# EAGLE design PCB_2layers (EAGLE 9.0.1)
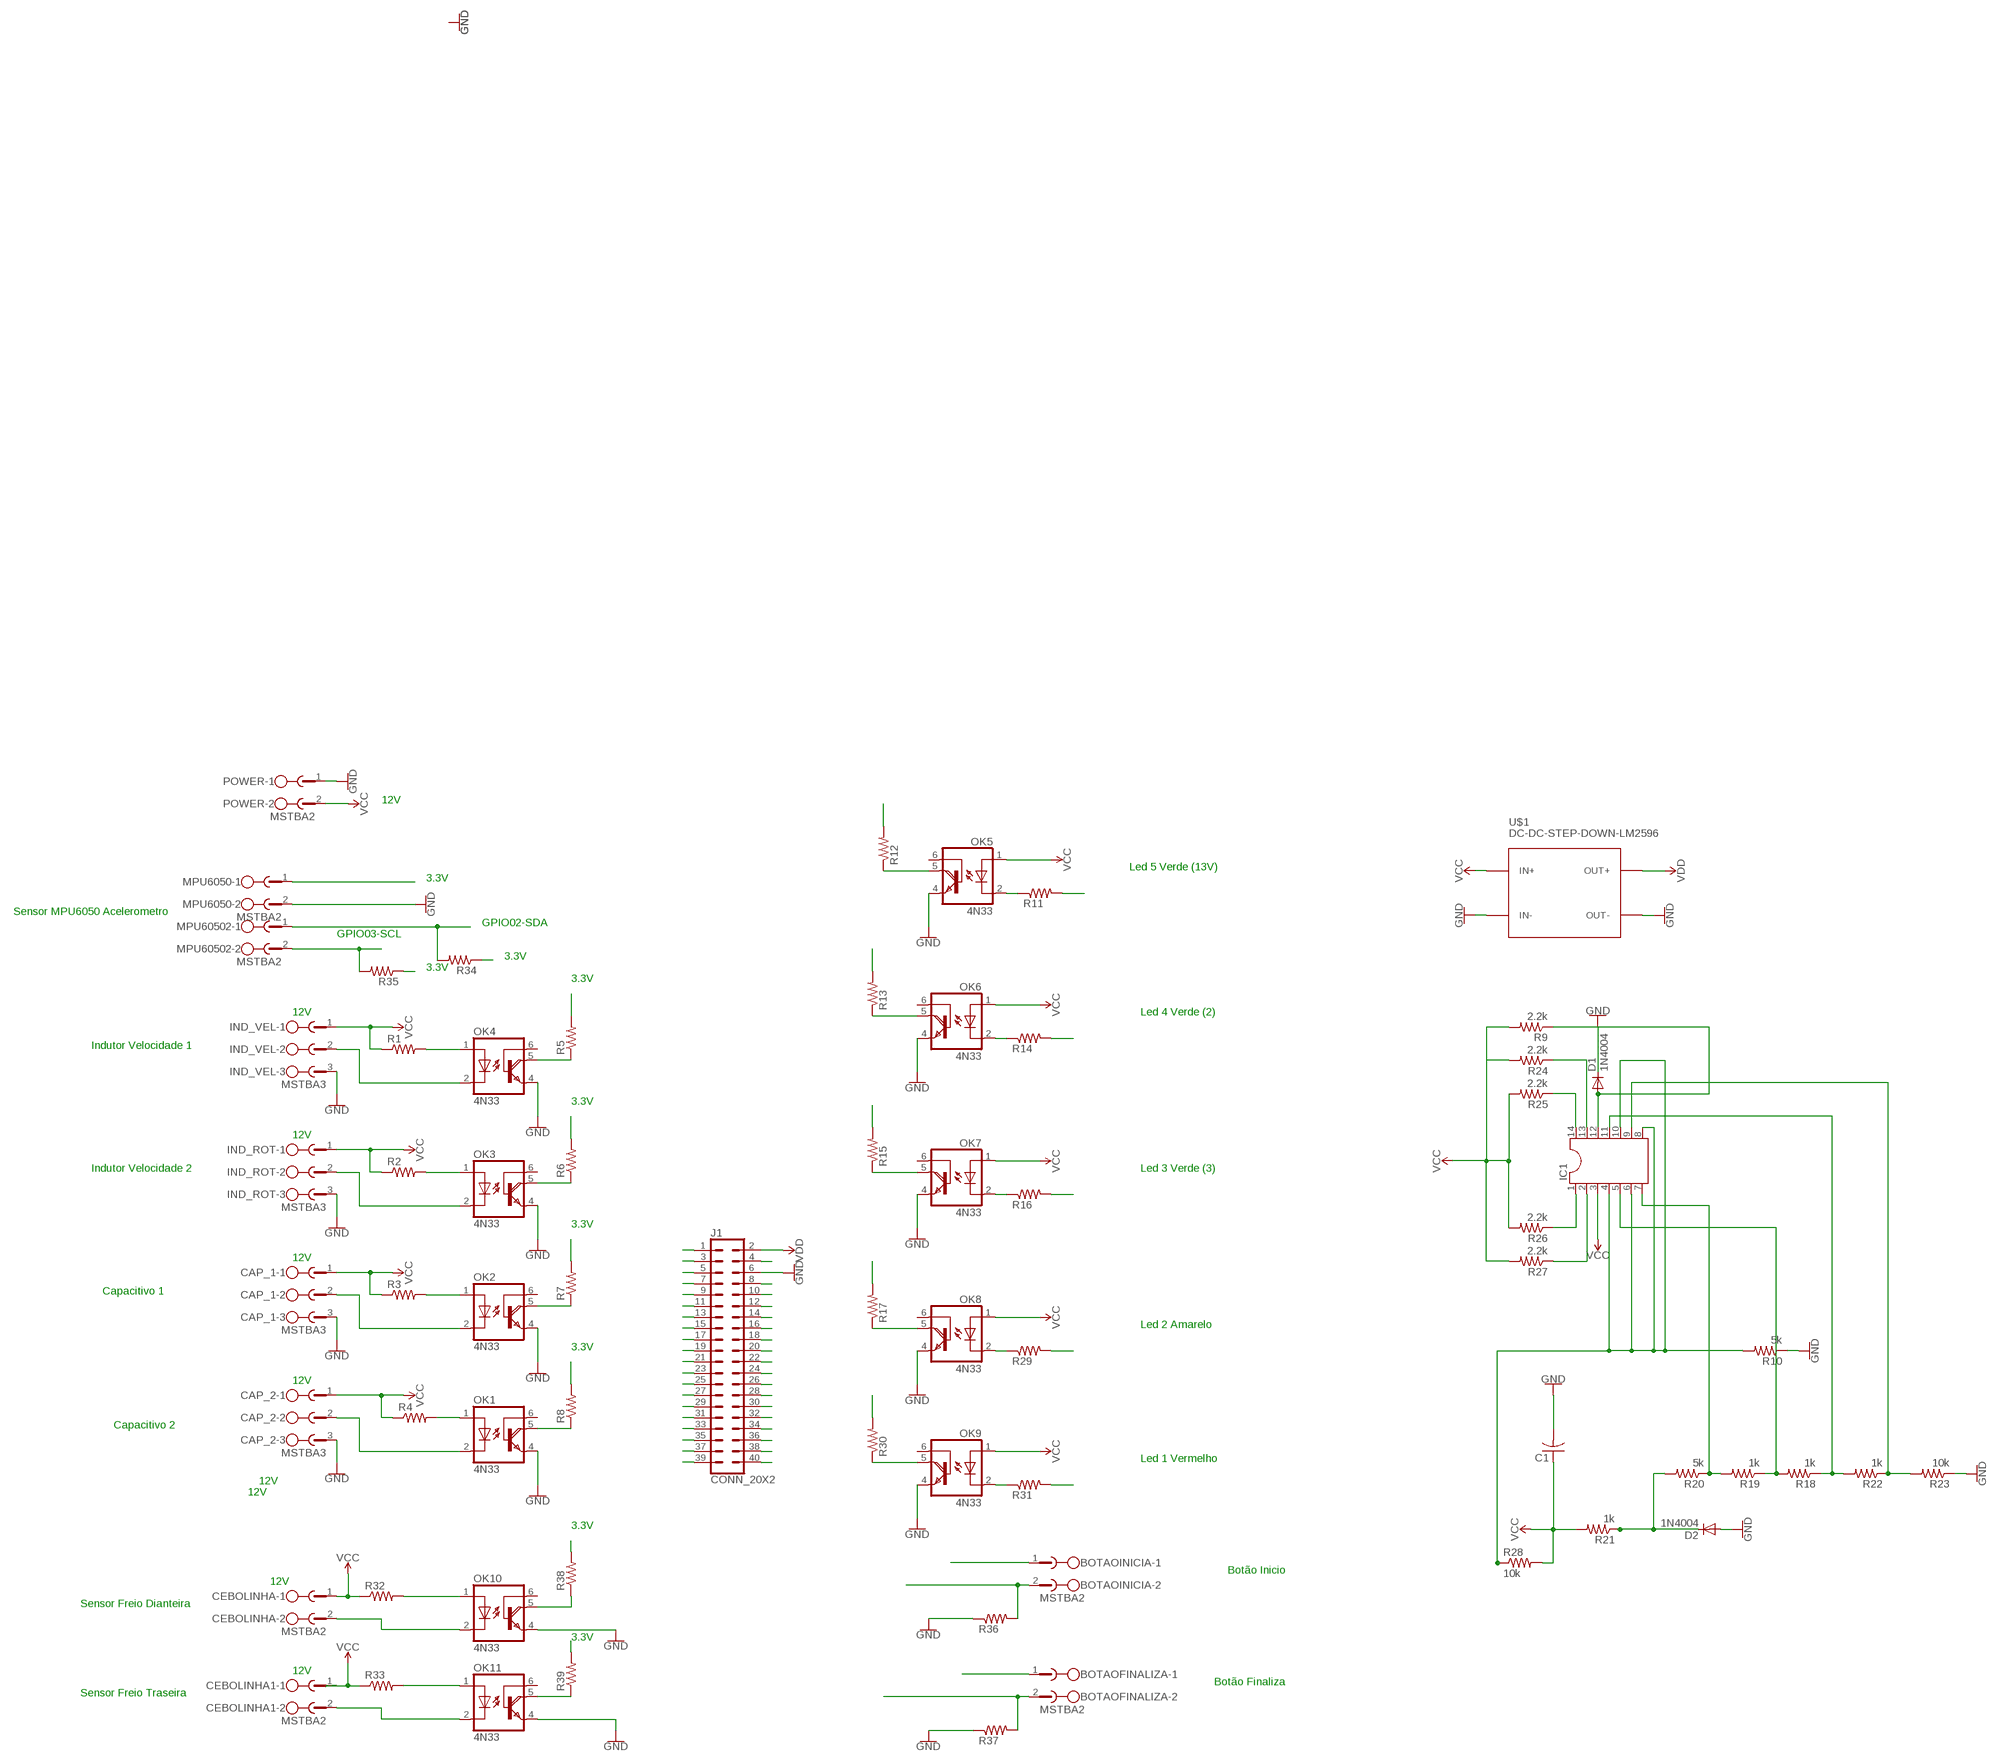
[diagram p0: schematic, sheet 1]

## Parts
BOTAOFINALIZA  MSTBA2  [MSTBA2]
BOTAOINICIA  MSTBA2  [MSTBA2]
C1  C-US025-050X050  [C025-050X050]
CAP_1  MSTBA3  [MSTBA3]
CAP_2  MSTBA3  [MSTBA3]
CEBOLINHA  MSTBA2  [MSTBA2]
CEBOLINHA1  MSTBA2  [MSTBA2]
D1  1N4004  [DO41-10]
D2  1N4004  [DO41-10]
IC1  DIL14  [DIL14]
IND_ROT  MSTBA3  [MSTBA3]
IND_VEL  MSTBA3  [MSTBA3]
J1  CONN_20X2  [2X20]
MPU6050  MSTBA2  [MSTBA2]
MPU60502  MSTBA2  [MSTBA2]
OK1  4N33  [DIL06]
OK2  4N33  [DIL06]
OK3  4N33  [DIL06]
OK4  4N33  [DIL06]
OK5  4N33  [DIL06]
OK6  4N33  [DIL06]
OK7  4N33  [DIL06]
OK8  4N33  [DIL06]
OK9  4N33  [DIL06]
OK10  4N33  [DIL06]
OK11  4N33  [DIL06]
POWER  MSTBA2  [MSTBA2]
R1  R-US_0204/7  [0204/7]
R2  R-US_0204/7  [0204/7]
R3  R-US_0204/7  [0204/7]
R4  R-US_0204/7  [0204/7]
R5  R-US_0204/7  [0204/7]
R6  R-US_0204/7  [0204/7]
R7  R-US_0204/7  [0204/7]
R8  R-US_0204/7  [0204/7]
R9  2.2k  R-US_0207/10  [0207/10]
R10  5k  R-US_0207/10  [0207/10]
R11  R-US_0204/7  [0204/7]
R12  R-US_0204/7  [0204/7]
R13  R-US_0204/7  [0204/7]
R14  R-US_0204/7  [0204/7]
R15  R-US_0204/7  [0204/7]
R16  R-US_0204/7  [0204/7]
R17  R-US_0204/7  [0204/7]
R18  1k  R-US_0207/10  [0207/10]
R19  1k  R-US_0207/10  [0207/10]
R20  5k  R-US_0207/10  [0207/10]
R21  1k  R-US_0207/10  [0207/10]
R22  1k  R-US_0207/10  [0207/10]
R23  10k  R-US_0207/10  [0207/10]
R24  2.2k  R-US_0207/10  [0207/10]
R25  2.2k  R-US_0207/10  [0207/10]
R26  2.2k  R-US_0207/10  [0207/10]
R27  2.2k  R-US_0207/10  [0207/10]
R28  10k  R-US_0207/10  [0207/10]
R29  R-US_0204/7  [0204/7]
R30  R-US_0204/7  [0204/7]
R31  R-US_0204/7  [0204/7]
R32  R-US_0204/7  [0204/7]
R33  R-US_0204/7  [0204/7]
R34  R-US_0204/7  [0204/7]
R35  R-US_0204/7  [0204/7]
R36  R-US_0204/7  [0204/7]
R37  R-US_0204/7  [0204/7]
R38  R-US_0204/7  [0204/7]
R39  R-US_0204/7  [0204/7]
U$1  DC-DC-STEP-DOWN-LM2596  [DC-DC-STEP-DOWN-LM2596]

## Nets
DC3.3V: BOTAOFINALIZA.1 BOTAOINICIA.1 J1.1 J1.17 MPU6050.1 R5.2 R6.2 R7.2 R8.2 R12.2 R13.2 R15.2 R17.2 R30.2 R34.1 R35.1 R38.2 R39.2
GND: C1.2 CAP_1.3 CAP_2.3 D1.C D2.A IND_ROT.3 IND_VEL.3 J1.6 J1.9 J1.14 J1.20 J1.25 J1.30 J1.34 OK1.4(E) OK2.4(E) OK3.4(E) OK4.4(E) OK5.4(E) OK6.4(E) OK7.4(E) OK8.4(E) OK9.4(E) OK10.4(E) OK11.4(E) POWER.1 R10.1 R23.1 R36.1 R37.1 U$1.IN- U$1.OUT-
GPIO01: CEBOLINHA1.2 OK11.2(C)
GPIO02: J1.3
GPIO2: MPU60502.2 R35.2
GPIO03: J1.5 MPU60502.1 R34.2
GPIO04: J1.7 OK4.5(COL) R5.1
GPIO05: J1.29
GPIO06: J1.31
GPIO07: J1.26
GPIO08: J1.24
GPIO09: J1.21
GPIO10: J1.19 OK1.5(COL) R8.1
GPIO11: CEBOLINHA.2 J1.23 OK10.2(C)
GPIO12: J1.32
GPIO13: J1.33
GPIO14: J1.8 OK5.5(COL) R12.1
GPIO15: J1.10 OK6.5(COL) R13.1
GPIO16: BOTAOINICIA.2 J1.36 R36.2
GPIO17: J1.11 OK3.5(COL) R6.1
GPIO18: J1.12 OK7.5(COL) R15.1
GPIO19: J1.35 OK10.5(COL) R38.1
GPIO20: BOTAOFINALIZA.2 J1.38 R37.2
GPIO21: J1.40
GPIO22: J1.15 OK2.5(COL) R7.1
GPIO23: J1.16 OK8.5(COL) R17.1
GPIO24: J1.18 OK9.5(COL) R30.1
GPIO25: J1.22
GPIO26: J1.37 OK11.5(COL) R39.1
GPIO27: J1.13
ID_SC: J1.28
ID_SD: J1.27
LM339P1: IC1.1 R11.2 R26.1
LM339P2: IC1.2 R14.2 R27.1
LM339P12: R31.2
LM339P13: IC1.13 R16.2 R24.1
LM339P14: IC1.14 R25.1 R29.2
LM33912: D1.A IC1.12 R9.1
N$1: IND_ROT.2 OK3.2(C)
N$2: CAP_2.2 OK1.2(C)
N$3: CAP_1.2 OK2.2(C)
N$4: OK3.1(A) R2.2
N$5: OK2.1(A) R3.2
N$6: OK1.1(A) R4.2
N$7: OK4.1(A) R1.2
N$8: IND_VEL.2 OK4.2(C)
N$13: D2.C R20.2 R21.1
N$14: IC1.9 R22.1 R23.2
N$15: IC1.4 IC1.6 IC1.8 IC1.10 R10.2 R28.1
N$16: IC1.5 R18.2 R19.1
N$17: IC1.11 R18.1 R22.2
N$18: IC1.7 R19.2 R20.1
N$22: J1.39
N$24: OK5.2(C) R11.1
N$27: OK6.2(C) R14.1
N$28: OK10.1(A) R32.2
N$29: OK7.2(C) R16.1
N$31: OK8.2(C) R29.1
N$33: OK9.2(C) R31.1
N$34: OK11.1(A) R33.2
VCC: C1.1 CAP_1.1 CAP_2.1 CEBOLINHA1.1 CEBOLINHA.1 IC1.3 IND_ROT.1 IND_VEL.1 OK5.1(A) OK6.1(A) OK7.1(A) OK8.1(A) OK9.1(A) POWER.2 R1.1 R2.1 R3.1 R4.1 R9.2 R21.2 R24.2 R25.2 R26.2 R27.2 R28.2 R32.1 R33.1 U$1.IN+
VDD: J1.2 J1.4 U$1.OUT+
Unconnected: MPU6050.2 OK1.6(B) OK2.6(B) OK3.6(B) OK4.6(B) OK5.6(B) OK6.6(B) OK7.6(B) OK8.6(B) OK9.6(B) OK10.6(B) OK11.6(B)

## Notes on the sheet
- 12V
- Led 5 Verde (13V)
- 3.3V
- Sensor MPU6050 Acelerometro
- GPIO02-SDA
- GPIO03-SCL
- 3.3V
- 3.3V
- 3.3V
- 12V | Led 4 Verde (2)
- Indutor Velocidade 1
- 3.3V
- 12V
- Indutor Velocidade 2 | Led 3 Verde (3)
- 3.3V
- 12V
- Capacitivo 1
- Led 2 Amarelo
- 3.3V
- 12V
- Capacitivo 2
- Led 1 Vermelho
- 12V
- 12V
- 3.3V
- Botão Inicio
- 12V
- Sensor Freio Dianteira
- 3.3V
- 12V
- Botão Finaliza
- Sensor Freio Traseira

## Library data of the parts
BOTAOFINALIZA BOTAOINICIA CEBOLINHA CEBOLINHA1 MPU6050 MPU60502 POWER = con-phoenix-508:MSTBA2: PHOENIX; MF: FARNELL; MPN: 1757242; OC_FARNELL: 3705171; OC_NEWARK: 71C4161
C1 = adafruit:C-US: CAPACITOR, American symbol
CAP_1 CAP_2 IND_ROT IND_VEL = con-phoenix-508:MSTBA3: PHOENIX; MF: FARNELL; MPN: 1757255; OC_FARNELL: 3705183; OC_NEWARK: 71C4162
D1 D2 = adafruit:1N4004: DIODE General purpose 1N400x type rectifier (With bigger pads) http://www.ladyada.net/library/pcb/eaglelibrary.html
IC1 = ic-package:DIL14: Dual In Line / Socket
J1 = SparkFun-Connectors:CONN_20X2: Multi connection point. Often used as Generic Header-pin footprint for 0.1 inch spaced/style header connections On any of the 0.1 inch spaced packages, you can populate with these: Break Away Headers - Straight <https://www.sparkfun.com/products/116> (PRT-00116) Break Away Male Headers - Right Angle <https://www.sparkfun.com/products/553> (PRT-00553) Female Headers <https://www.sparkfun.com/products/115> (PRT-00115) Break Away Headers - Machine Pin <https://www.sparkfun.com/products/117> (PRT-00117) Break Away Female Headers - Swiss Machine Pin <https://www.sparkfun.com/products/743> (PRT-00743)
OK1-OK11 = optocoupler:4N33: MOTOROLA OPTO COUPLER; MF: VISHAY/TELEFUNKEN; MPN: 4N33; OC_FARNELL: 1469601; OC_NEWARK: 88K1390
R1-R8 R11-R17 R29-R39 = rcl:R-US_: RESISTOR, American symbol
R9 R10 R18-R28 = adafruit:R-US_: RESISTOR, American symbol
U$1 = diy-modules:DC-DC-STEP-DOWN-LM2596: DC/DC Step-Down Regulator based on LM2596-ADJ chip LM2596 datasheet available here: http://www.ti.com/lit/ds/symlink/lm2596.pdf Click here to find device on ebay.com <http://www.ebay.com/sch/lm2596+power+regulator>

## Net classes
0 default: width 0.813 mm, drill 0.813 mm, clearance 0.152 mm
1 pwr: width 0.813 mm, clearance 0.254 mm

## Board
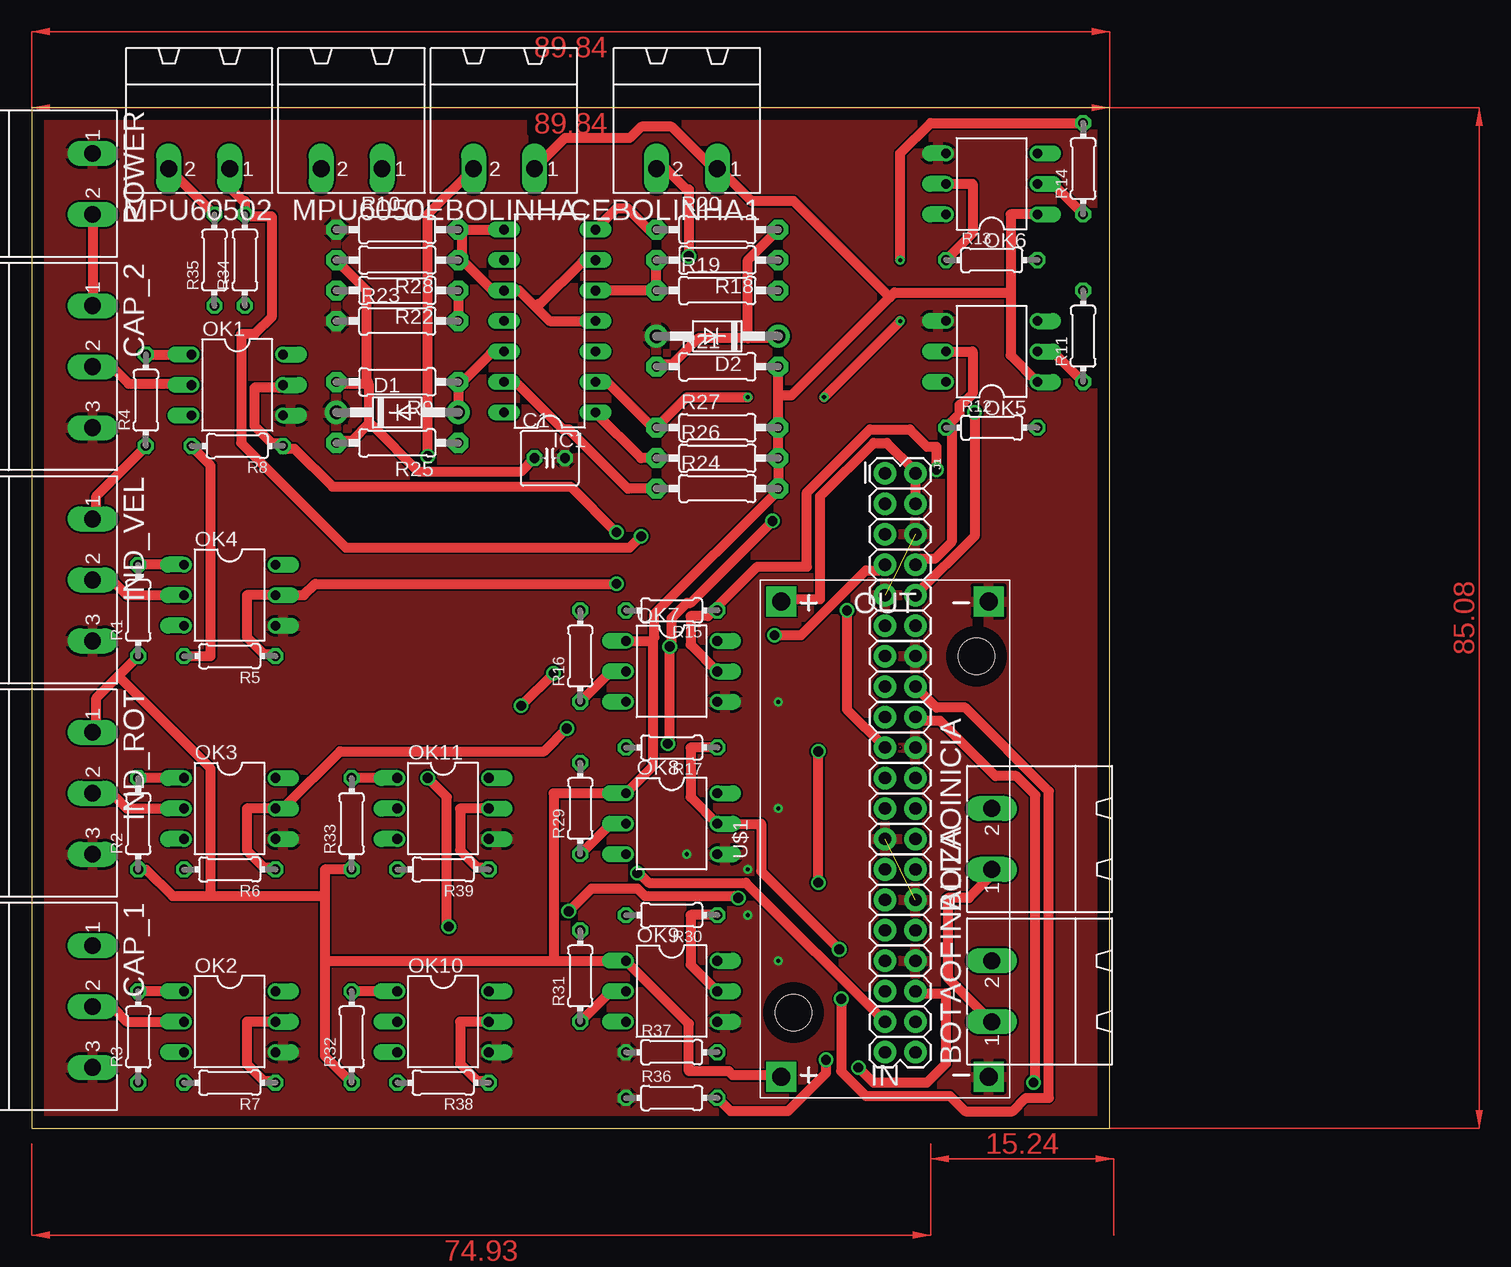
[diagram p1: board, top side]
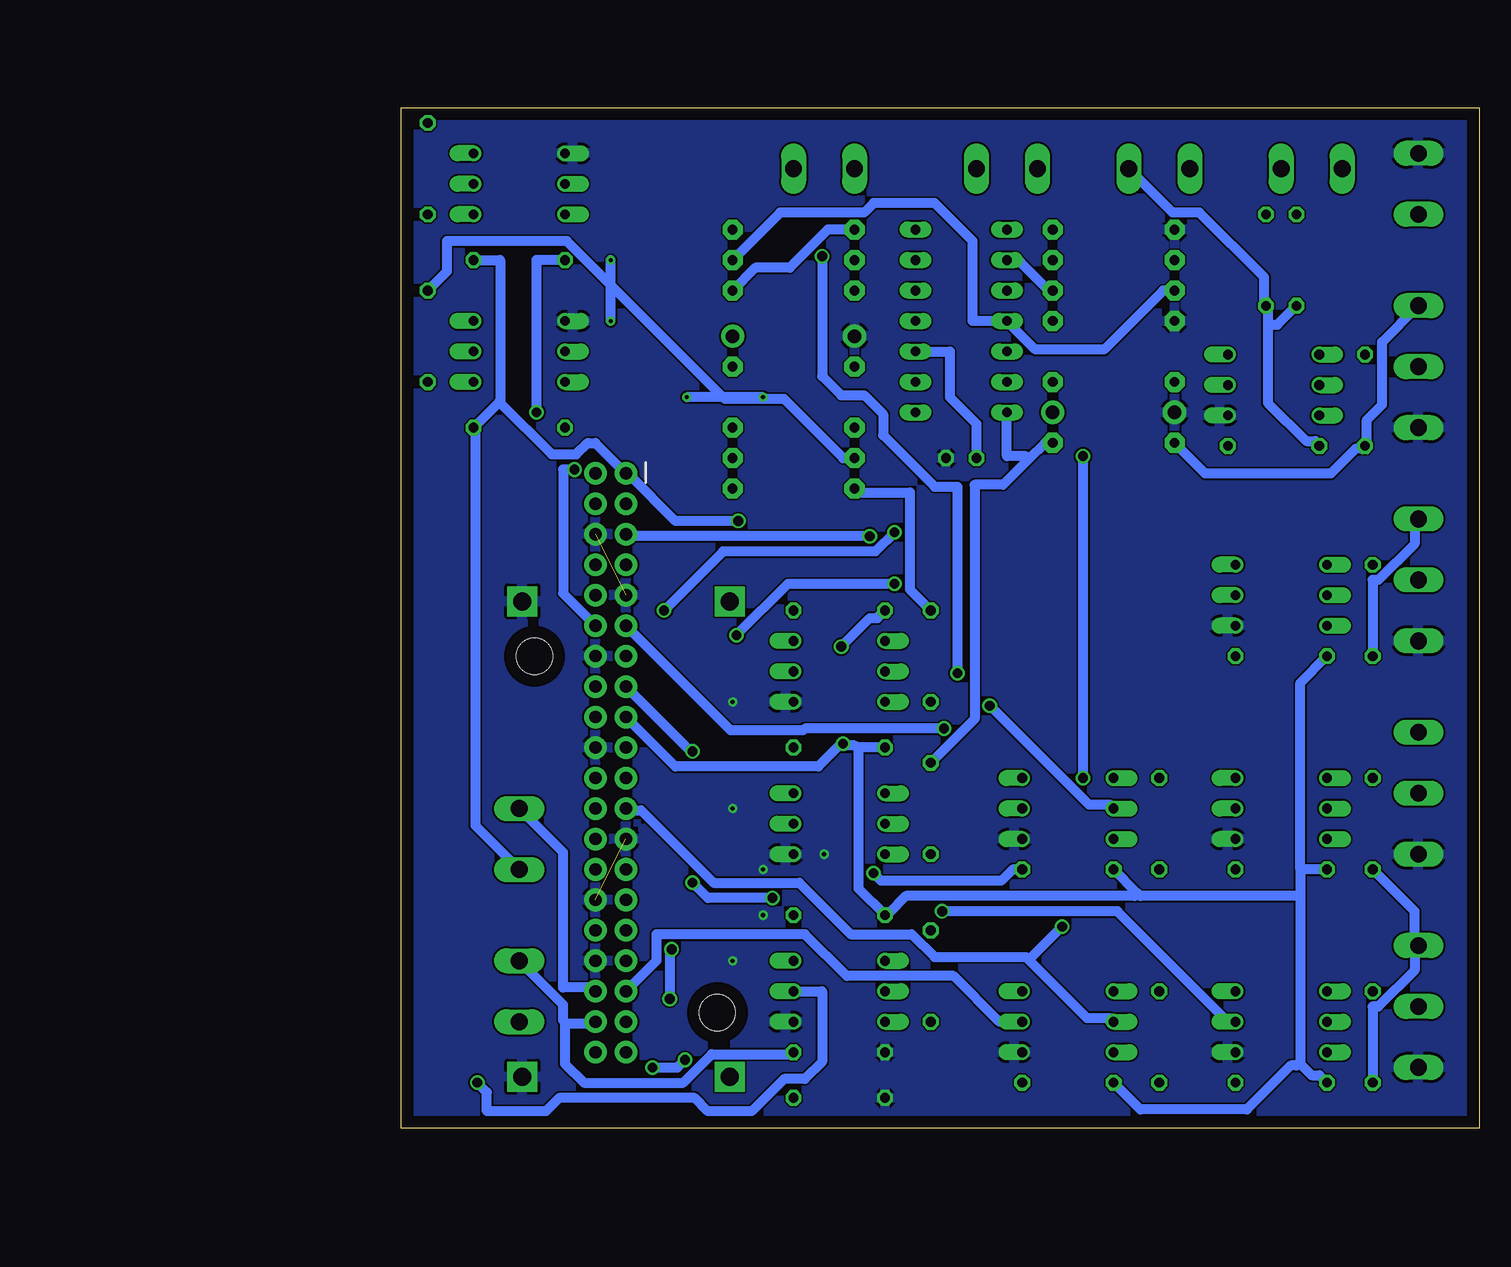
[diagram p2: board, bottom side, seen from below]

Size 89.84 x 85.08 mm. Coordinates in mm from the lower left corner, seen from the top.
Outline: 0,0 89.84,0 89.84,85.08 0,85.08 0,0
Copper layers (1*16): Top 0.035mm / dielectric 1.5mm / Bottom 0.035mm
Design rules "default": minimum track width 6mil, minimum drill 0.35mm, track to track 6mil, track to pad 6mil, pad to pad 6mil, via to via 6mil, smd to smd 6mil, copper to edge 40mil, drill to drill 6mil, minimum pad ring 10mil, minimum via ring 8mil, stop-mask expansion 4mil, vias tented up to drill 0mil, thermal gap 10mil

### Footprints (pad centres in the part's own frame; a part is rotated, then mirrored left to right if it is on the bottom)
MSTBA2 = drill 1.397 long: 1 -2.54,5.08; 2 2.54,5.08
C025-050X050 = drill 0.813 octagon: 1 -1.27,0; 2 1.27,0
MSTBA3 = drill 1.397 long: 1 -5.08,5.08; 2 0,5.08; 3 5.08,5.08
DO41-10 = drill 1.118 pad 1.93: A 5.08,0; C -5.08,0
DIL14 = drill 0.813 long: 1 -7.62,-3.81; 2 -5.08,-3.81; 3 -2.54,-3.81; 4 0,-3.81; 5 2.54,-3.81; 6 5.08,-3.81; 7 7.62,-3.81; 8 7.62,3.81; 9 5.08,3.81; 10 2.54,3.81; 11 0,3.81; 12 -2.54,3.81; 13 -5.08,3.81; 14 -7.62,3.81
2X20 = drill 1.016 pad 1.88: 1 0,0; 2 0,2.54; 3 2.54,0; 4 2.54,2.54; 5 5.08,0; 6 5.08,2.54; 7 7.62,0; 8 7.62,2.54; 9 10.16,0; 10 10.16,2.54; 11 12.7,0; 12 12.7,2.54; 13 15.24,0; 14 15.24,2.54; 15 17.78,0; 16 17.78,2.54; 17 20.32,0; 18 20.32,2.54; 19 22.86,0; 20 22.86,2.54; 21 25.4,0; 22 25.4,2.54; 23 27.94,0; 24 27.94,2.54; 25 30.48,0; 26 30.48,2.54; 27 33.02,0; 28 33.02,2.54; 29 35.56,0; 30 35.56,2.54; 31 38.1,0; 32 38.1,2.54; 33 40.64,0; 34 40.64,2.54; 35 43.18,0; 36 43.18,2.54; 37 45.72,0; 38 45.72,2.54; 39 48.26,0; 40 48.26,2.54
DIL06 = drill 0.813 offset: 1 -2.54,-3.81; 2 0,-3.81; 3 2.54,-3.81; 4 2.54,3.81; 5 0,3.81; 6 -2.54,3.81
0204/7 = drill 0.813 octagon: 1 -3.81,0; 2 3.81,0
0207/10 = drill 0.813 pad 1.676 octagon: 1 -5.08,0; 2 5.08,0
DC-DC-STEP-DOWN-LM2596 = drill 1.5 pad 2.5 square: IN+ -19.812,8.636; IN- -19.812,-8.636; OUT+ 19.812,8.636; OUT- 19.812,-8.636 | hole 3: -14.478,7.62; 15.24,-7.62

### Placement (x,y rotation side)
BOTAOFINALIZA  85.09,11.43 90 top
BOTAOINICIA  85.09,24.13 90 top
C1  43.18,55.88 0 top
CAP_1  0,10.16 270 top
CAP_2  0,63.5 270 top
CEBOLINHA  39.37,85.09 180 top
CEBOLINHA1  54.61,85.09 180 top
D1  30.48,59.69 0 top
D2  57.15,66.04 180 top
IC1  43.18,67.31 90 top
IND_ROT  0,27.94 270 top
IND_VEL  0,45.72 270 top
J1  71.12,54.61 270 top
MPU6050  26.67,85.09 180 top
MPU60502  13.97,85.09 180 top
OK1  17.15,61.98 270 top
OK2  16.51,8.89 270 top
OK3  16.51,26.67 270 top
OK4  16.51,44.45 270 top
OK5  80.01,64.77 90 top
OK6  80.01,78.74 90 top
OK7  53.34,38.1 270 top
OK8  53.34,25.4 270 top
OK9  53.34,11.43 270 top
OK10  34.29,8.89 270 top
OK11  34.29,26.67 270 top
POWER  0,78.74 270 top
R1  8.89,43.18 90 top
R2  8.89,25.4 90 top
R3  8.89,7.62 90 top
R4  9.53,60.71 90 top
R5  16.51,39.37 180 top
R6  16.51,21.59 180 top
R7  16.51,3.81 180 top
R8  17.15,56.9 180 top
R9  30.48,62.23 180 top
R10  30.48,74.93 0 top
R11  87.63,66.04 90 top
R12  80.01,58.42 0 top
R13  80.01,72.39 0 top
R14  87.63,80.01 90 top
R15  53.34,43.18 180 top
R16  45.72,39.37 90 top
R17  53.34,31.75 180 top
R18  57.15,72.39 180 top
R19  57.15,69.85 0 top
R20  57.15,74.93 0 top
R21  57.15,63.5 0 top
R22  30.48,69.85 180 top
R23  30.48,67.31 0 top
R24  57.15,53.34 0 top
R25  30.48,57.15 180 top
R26  57.15,55.88 0 top
R27  57.15,58.42 0 top
R28  30.48,72.39 180 top
R29  45.72,26.67 90 top
R30  53.34,17.78 180 top
R31  45.72,12.7 90 top
R32  26.67,7.62 90 top
R33  26.67,25.4 90 top
R34  17.78,72.39 90 top
R35  15.24,72.39 90 top
R36  53.34,2.54 0 top
R37  53.34,6.35 0 top
R38  34.29,3.81 180 top
R39  34.29,21.59 180 top
U$1  71.12,24.13 90 top

### Tracks (layer width: path | path; a pad name or v marks a point on that pad's centre or on a via)
DC3.3V  (via drill 0.81)
  Top 0.813: BOTAOFINALIZA.1 76.36,12.54 76.36,19.21 78.11,19.21 80.01,21.11 BOTAOINICIA.1 | v53.02,32.07 53.18,32.07 v53.18,40.16 53.34,40.48 53.34,42.55 54.61,43.81 54.93,43.81 v61.75,50.64 | R5.2 14.92,39.37 14.92,55.25 13.34,56.83 R8.2
  Bottom 0.813: 81.68,60.56 81.6,60.64 81.6,72.39 R13.2 | 81.68,60.56 R12.2 83.66,58.1 83.66,25.24 BOTAOINICIA.1 | 81.68,60.56 77.31,56.2 75.25,56.2 74.3,57.15 73.66,57.15 J1.1 70.8,54.45 66.99,50.64 v61.75,50.64 | 51.75,31.75 51.75,20 R30.2 49.21,17.94 47.78,19.37 28.73,19.37 28.5,19.61 | R17.2 51.75,31.75 | R15.2 50.17,42.55 50.8,42.55 v53.18,40.16 | 51.75,31.75 52.07,31.91 52.86,31.91 v53.02,32.07 53.34,31.91 55.09,30.16 66.99,30.16 J1.17 | 17.62,66.99 17.62,68.58 R34.1 17.94,68.9 17.94,70.96 23.34,76.36 25.56,76.36 MPU6050.1 | 17.62,66.99 17.62,60.48 14.45,57.31 13.65,57.31 13.34,56.99 R8.2 | R35.1 16.83,66.99 17.62,66.99 | R7.2 13.34,4.45 13.97,4.45 14.92,5.4 | 14.92,21.59 14.92,19.37 | 14.92,19.37 14.92,5.4 | R6.2 14.92,21.59 | R38.2 28.26,1.59 19.37,1.59 15.72,5.24 15.24,5.24 14.92,5.4 | R5.2 14.92,37.15 14.92,21.59 | 28.5,19.61 28.26,19.37 14.92,19.37 | 28.5,19.61 R39.2
GND  (via drill 0.35)  (2 unrouted)
  other vias: 62.23,35.56 62.23,26.67 62.23,13.97 54.61,22.86 59.69,21.59 59.69,17.78
  pour Bottom: 0,88.9 -1.27,87.63 -1.27,-1.27 0,-2.54 90.17,-2.54 91.44,-1.27 91.44,86.36 88.9,88.9
  pour Top: -1.27,87.63 -1.27,-1.27 0,-2.54 90.17,-2.54 91.44,-1.27 91.44,86.36 88.9,88.9 0,88.9
GPIO01  (via drill 0.81)
  Top 0.813: v43.5,37.94 v40.8,35.24 | v54.77,72.71 54.77,78.26 54.61,78.26 52.86,80.01 CEBOLINHA1.2
  Bottom 0.813: OK11.2 30.8,26.99 32.54,26.99 v40.8,35.24 | v43.5,37.94 43.5,53.5 45.4,53.5 49.69,57.78 49.69,59.53 51.28,61.12 53.18,61.12 54.77,62.71 v54.77,72.71
GPIO2
  Top 0.813: MPU60502.2 R35.2
GPIO03  (via drill 0.81)
  Top 0.813: MPU60502.1 16.51,78.42 17.62,77.31 17.78,77.31 R34.2 18.1,76.04 20,76.04 20,67.63 18.57,66.2 17.46,66.2 17.46,57.15 26.19,48.42 49.85,48.42 v50.8,49.37
  Bottom 0.813: J1.5 70.96,49.37 v50.8,49.37
GPIO04  (via drill 0.81)
  Top 0.813: R5.1 20.16,39.53 19.37,39.53 17.94,40.96 17.94,44.45 OK4.5 22.7,44.45 23.65,45.4 v48.74,45.4 | J1.7 70.64,46.51 69.53,46.51 64.14,41.12 v61.91,41.12
  Bottom 0.813: v61.91,41.12 57.63,45.4 v48.74,45.4
GPIO10  (via drill 0.81)
  Top 0.813: OK1.5 20.96,61.91 20.8,61.91 20.64,61.75 18.57,61.75 18.57,58.58 20,57.15 20.8,57.15 20.96,56.99 R8.1 21.27,56.67 21.91,56.67 25.08,53.5 44.93,53.5 v48.74,49.69 | J1.19 67.95,34.92 v67.95,43.18
  Bottom 0.813: v67.95,43.18 63.02,48.1 50.32,48.1 v48.74,49.69
GPIO11  (via drill 0.81)
  Top 0.813: CEBOLINHA.2 33.02,76.2 v33.02,56.04 | v33.02,29.21 34.61,27.62 34.61,16.83 v34.77,16.83
  Bottom 0.813: OK10.2 30.8,9.21 32.7,9.21 37.54,14.05 | 37.54,14.05 37.78,14.29 45.4,14.29 47.31,16.19 52.39,16.19 56.67,20.48 63.82,20.48 69.85,26.51 70.96,26.51 J1.23 | v33.02,29.21 v33.02,56.04 | 37.54,14.05 v34.77,16.83
GPIO14
  Top 0.813: OK5.5 78.42,64.77 78.42,61.28 77.47,60.33 77.31,60.33 77.31,59.53 R12.1 76.52,58.26 76.68,58.26 76.68,48.89 75.25,47.47 74.14,47.47 J1.8
GPIO15  (via drill 0.81)
  Top 0.813: R13.1 78.42,74.61 78.42,78.74 OK6.5 | J1.10 78.58,49.37 v78.58,59.69
  Bottom 0.813: v78.58,59.69 78.58,72.39 R13.1
GPIO16  (via drill 0.81)
  Top 0.813: R36.2 58.26,1.43 63.02,1.43 66.2,4.6 v66.2,5.72 | v68.9,5.08 70.17,3.81 74.61,3.81 76.2,5.4 76.2,11.27 73.82,11.27 J1.36
  Bottom 0.813: v66.2,5.72 66.83,5.08 v68.9,5.08 | BOTAOINICIA.2 76.36,23.02 76.36,11.75 74.3,11.75 73.98,11.43 J1.36
GPIO17  (via drill 0.81)
  Top 0.813: R6.1 20.16,21.75 19.37,21.75 17.94,23.18 17.94,26.67 OK3.5 20.64,26.83 21.11,26.83 25.72,31.43 42.7,31.43 v44.61,33.34
  Bottom 0.813: J1.11 62.39,33.18 56.36,33.18 56.2,33.34 v44.61,33.34
GPIO18  (via drill 0.81)
  Top 0.813: OK7.5 54.93,40.32 54.93,42.7 56.36,42.7 56.83,43.18 R15.1 57.15,43.5 60.48,46.83 64.61,46.83 64.61,53.02 69.85,58.26 73.18,58.26 74.61,56.83 75.41,56.83 v75.41,54.93
  Bottom 0.813: J1.12 76.36,44.61 76.36,54.93 v75.41,54.93
GPIO19
  Top 0.813: R38.1 37.94,3.97 37.15,3.97 35.72,5.4 35.72,8.89 OK10.5
  Bottom 0.813: J1.35 68.58,13.97 68.58,16.19 56.2,16.19 52.71,12.7 43.82,12.7 40.01,8.89 OK10.5
GPIO20
  Bottom 0.813: R37.2 57.31,6.19 63.98,6.19 66.36,3.81 74.61,3.81 76.2,5.4 76.2,8.73 | 76.2,8.73 73.82,8.73 J1.38 | BOTAOFINALIZA.2 76.36,10.32 76.36,9.05 76.2,8.73
GPIO22  (via drill 0.81)
  Top 0.813: R7.1 20.16,3.97 19.37,3.97 17.94,5.4 17.94,8.89 OK2.5 | v65.56,20.48 v65.56,31.43 | v58.9,19.21 58.74,19.37 51.12,19.37 50.48,20 46.67,20 v44.77,18.1
  Bottom 0.813: J1.15 65.72,31.43 v65.56,31.43 | v65.56,20.48 64.29,19.21 v58.9,19.21 | v44.77,18.1 30.16,18.1 20.96,8.89 OK2.5
GPIO23  (via drill 0.81)
  Top 0.813: R17.1 54.93,31.75 54.93,27.62 OK8.5 60.8,25.4 60.8,21.43 v67.31,14.92 | J1.16 75.41,35.08 77.79,35.08 84.77,28.1 84.77,2.54 82.87,2.54 81.76,1.43 77.79,1.43 76.52,2.7 69.53,2.7 67.47,4.76 v67.47,10.8
  Bottom 0.813: v67.47,10.8 67.47,14.92 v67.31,14.92
GPIO24  (via drill 0.81)
  Top 0.813: OK9.5 54.93,13.65 54.93,17.78 R30.1 | J1.18 73.98,33.97 75.72,33.97 80.33,29.37 82.07,29.37 83.66,27.78 83.66,3.81 v83.5,3.81
  Bottom 0.813: v83.5,3.81 82.71,3.02 82.71,1.43 77.79,1.43 76.68,2.54 65.41,2.54 64.29,1.43 60.64,1.43 57.94,4.13 56.2,4.13 54.77,5.56 54.77,11.43 OK9.5
GPIO26  (via drill 0.81)
  Top 0.813: R39.1 37.94,21.75 37.15,21.75 35.72,23.18 35.72,26.67 OK11.5 | J1.37 59.53,20.48 51.44,20.48 50.64,21.27 v50.48,21.27
  Bottom 0.813: v50.48,21.27 49.85,20.64 39.85,20.64 38.89,21.59 R39.1
LM339P1
  Top 0.813: IC1.1 50.8,55.88 R26.1
  Bottom 0.813: R11.2 86.04,71.44 86.04,73.98 76.04,73.98 62.87,60.8 57.94,60.8 53.02,55.88 R26.1
LM339P2  (via drill 0.35)
  Top 0.813: IC1.2 47.15,62.07 48.1,62.07 51.75,58.42 R27.1 54.61,60.96 v59.69,60.96 | v66.04,60.96 v72.39,67.31 | v72.39,72.39 72.39,81.28 74.93,83.82 R14.2
  Bottom 0.813: v59.69,60.96 v66.04,60.96 | v72.39,67.31 v72.39,72.39
LM339P13
  Top 0.813: IC1.13 39.53,62.07 40.48,62.07 44.29,58.26 44.77,58.26 49.69,53.34 R24.1
  Bottom 0.813: R16.2 47.47,44.93 47.47,53.02 51.59,53.02 51.91,53.34 R24.1
LM339P14
  Bottom 0.813: R29.2 42.07,34.13 42.07,53.66 39.69,53.66 37.54,55.8 | 37.54,55.8 36.2,57.15 R25.1 | IC1.14 39.37,56.04 37.78,56.04 37.54,55.8
LM33912
  Top 0.813: IC1.12 39.21,64.61 38.26,64.61 35.88,62.23 R9.1 D1.A
N$1
  Top 0.813: OK3.2 7.94,26.67 6.67,27.94 IND_ROT.2
N$2
  Top 0.813: CAP_2.2 6.67,63.5 8.1,62.07 13.34,62.07 OK1.2
N$3
  Top 0.813: OK2.2 7.94,8.89 6.67,10.16 CAP_1.2
N$4
  Top 0.813: OK3.1 R2.2
N$5
  Top 0.813: OK2.1 R3.2
N$6
  Top 0.813: R4.2 9.53,64.45 13.34,64.45 OK1.1
N$7
  Top 0.813: OK4.1 R1.2
N$8
  Top 0.813: OK4.2 7.94,44.45 6.67,45.72 IND_VEL.2
N$13
  Top 0.813: R21.1 52.23,63.66 53.34,63.66 55.56,65.88 59.69,65.88 | 59.69,65.88 62.07,65.88 D2.C | R20.2 59.69,72.39 59.69,65.88
N$14
  Top 0.813: R22.1 R23.2
  Bottom 0.813: IC1.9 39.21,72.23 38.26,72.23 35.88,69.85 R22.1
N$15
  Top 0.813: IC1.8 R10.2 35.88,74.61 35.88,72.71 R28.1 35.88,72.39 38.26,70.01 39.21,70.01 IC1.10 40.64,69.85 41.99,68.5 | IC1.4 43.18,67.31 41.99,68.5 | IC1.6 46.83,72.23 45.88,72.23 42.39,68.74 42.23,68.74 41.99,68.5
N$16
  Top 0.813: IC1.5 R19.1 R18.2
N$17
  Bottom 0.813: R22.2 26.35,69.85 31.27,64.93 36.99,64.93 IC1.11 42.23,67.31 42.23,73.98 45.4,77.15 50.48,77.15 51.28,76.36 58.26,76.36 R18.1
N$18
  Top 0.813: IC1.7 48.74,76.68 49.69,76.68 51.44,74.93 R20.1
  Bottom 0.813: R19.2 60.33,71.75 57.47,71.75 54.29,74.93 R20.1
N$24
  Top 0.813: R11.1 85.09,64.77 OK5.2
N$27
  Top 0.813: R14.1 85.09,78.74 OK6.2
N$28
  Top 0.813: OK10.1 R32.2
N$29
  Top 0.813: R16.1 48.26,38.1 OK7.2
N$31
  Top 0.813: R29.1 48.26,25.4 OK8.2
N$33
  Top 0.813: R31.1 48.26,11.43 OK9.2
N$34
  Top 0.813: OK11.1 R33.2
VCC
  Top 0.813: R25.2 25.56,57.31 26.67,57.31 28.1,58.74 | 28.1,62.07 28.1,58.74 | 28.1,62.07 25.56,62.07 R9.2 | R28.2 27.94,69.85 27.94,62.39 28.1,62.07 | C1.1 40.8,54.77 32.23,54.77 28.42,58.58 28.1,58.74 | 7.22,37.7 5.4,35.88 5.4,33.02 IND_ROT.1 | 7.22,37.7 R1.1 | POWER.2 CAP_2.1 | IND_VEL.1 5.4,50.8 5.4,52.7 9.53,56.83 R4.1 | U$1.IN+ 62.39,4.45 58.42,4.45 58.1,4.76 54.77,4.76 54.77,8.73 OK9.1 43.5,13.97 | R32.1 24.45,6.03 24.45,13.97 | 24.45,19.37 24.45,21.59 R33.1 | 24.45,19.37 24.45,13.97 | 14.92,19.37 11.75,19.37 9.53,21.59 R2.1 | 14.92,19.37 24.45,19.37 | 24.45,13.97 43.5,13.97 | CEBOLINHA.1 44.45,82.55 49.85,82.55 50.8,83.5 53.34,83.5 56.83,80.01 CEBOLINHA1.1 57.47,79.85 60.01,77.31 63.5,77.31 71.52,69.29 | OK5.1 81.6,64.45 81.6,69.69 | 81.6,69.69 81.6,76.2 OK6.1 | 62.23,61.12 R27.2 R26.2 R24.2 62.07,53.02 51.91,42.86 51.91,40.96 51.75,40.64 | 62.23,61.12 R21.2 | 51.75,40.64 51.75,30.16 OK8.1 43.5,27.94 43.5,13.97 | OK7.1 51.75,40.64 | 81.6,69.69 71.91,69.69 71.52,69.29 | 71.52,69.29 63.34,61.12 62.23,61.12 | 7.22,37.7 14.92,30 14.92,19.37
  Bottom 0.813: C1.1 41.91,58.74 44.13,60.96 44.13,64.77 IC1.3 | CAP_2.1 8.1,65.56 8.1,60.33 9.37,59.06 9.37,56.99 9.53,56.99 R4.1 9.84,56.67 10.32,56.67 12.38,54.61 22.86,54.61 R25.2 | R1.1 8.89,45.72 8.41,45.72 5.4,48.74 5.4,50.8 IND_VEL.1 | R3.1 8.89,10.16 8.41,10.16 5.4,13.18 5.4,15.24 CAP_1.1 5.4,15.56 5.4,18.1 R2.1
VDD
  Top 0.813: J1.4 J1.2 73.5,54.93 71.28,57.15 70.17,57.15 65.72,52.7 65.72,44.13 62.71,44.13 62.55,43.97 U$1.OUT+
(copper drawn outside any net)
  shapes: Top area x6